# Altium project EIT_Teensybasedv1.PrjPcb (part 3 of 3)

## Sheet EIT_Teensy_Amplifiers.SchDoc: EIT Teensy Amplifiers
size A4; Author: Llewellyn Sims Johns
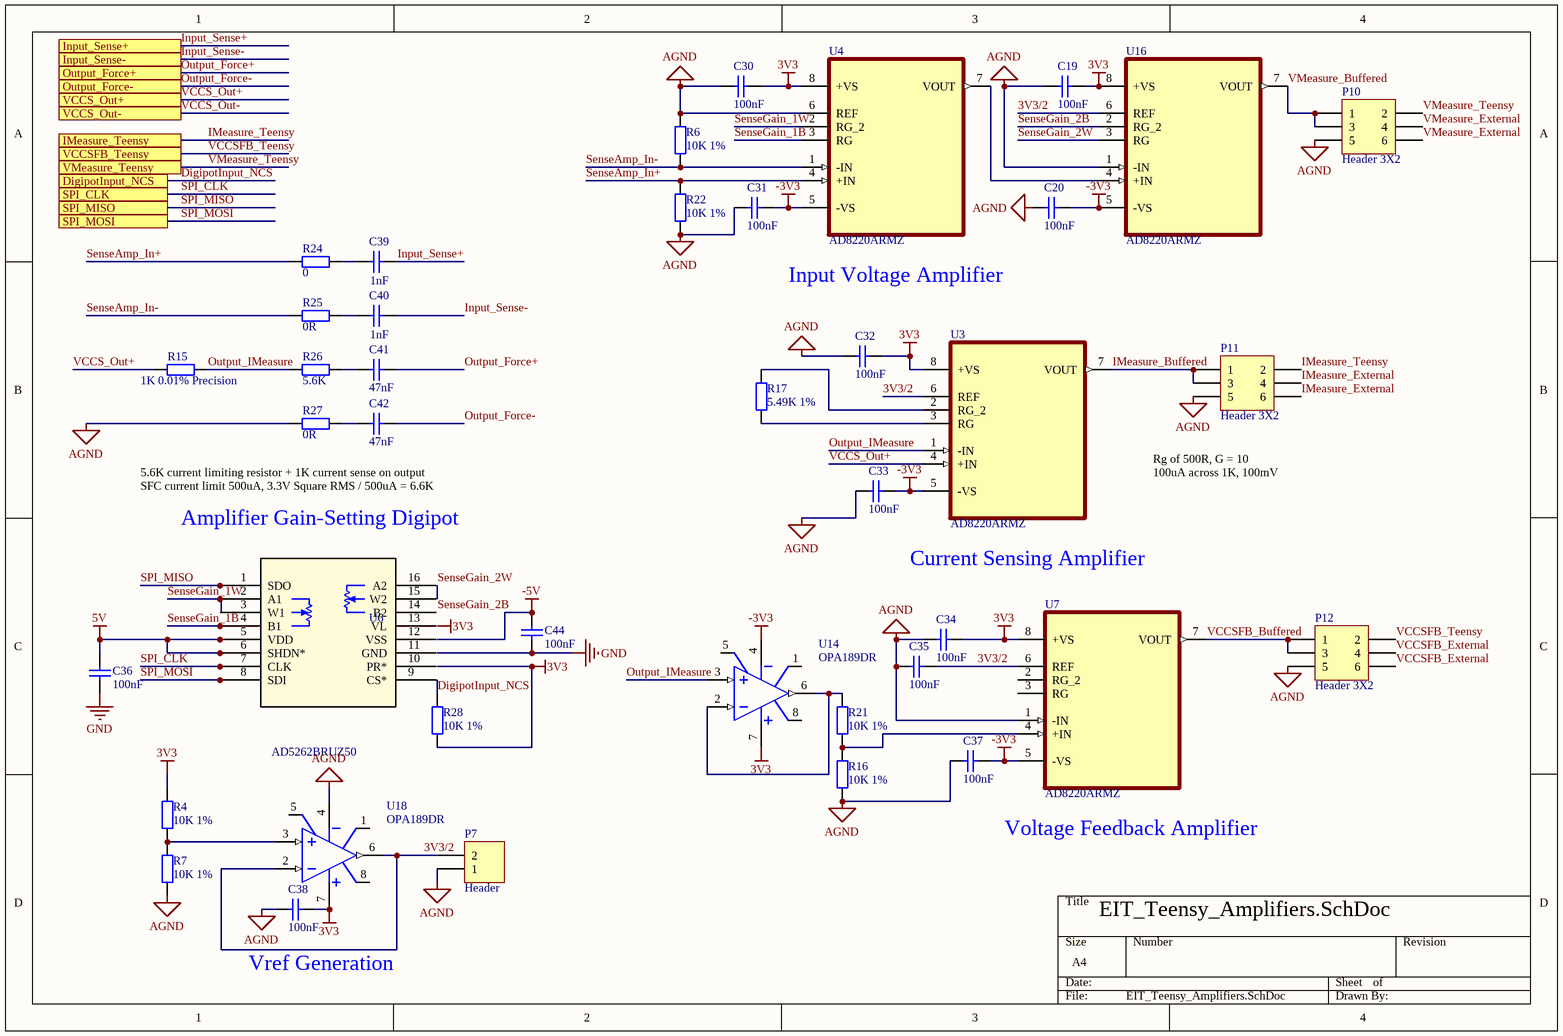
[diagram p7: EIT_Teensy_Amplifiers.SchDoc]

### Parts
C19  100nF  [0603 CAP]
C20  100nF  [0603 CAP]
C30  100nF  [0603 CAP]
C31  100nF  [0603 CAP]
C32  100nF  [0603 CAP]
C33  100nF  [0603 CAP]
C34  100nF  [0603 CAP]
C35  100nF  [0603 CAP]
C36  100nF  [0603 CAP]
C37  100nF  [0603 CAP]
C38  100nF  [0603 CAP]
C39  value 1nF  [RAD-0.3]  (hidden comment: Cap)
C40  value 1nF  [RAD-0.3]  (hidden comment: Cap)
C41  47nF  [0603 CAP]
C42  47nF  [0603 CAP]
C44  100nF  [0603 CAP]
P7  Header  [HEADER 2.54MM 2X1 MALE]
P10  Header 3X2  [HDR2X3 Male 2.54mm]
P11  Header 3X2  [HDR2X3 Male 2.54mm]
P12  Header 3X2  [HDR2X3 Male 2.54mm]
R4  10K 1%  [0603 RES]
R6  10K 1%  [0603 RES]
R7  10K 1%  [0603 RES]
R15  1K 0.01% Precision  [0603 RES]
R16  10K 1%  [0603 RES]
R17  5.49K 1%  [0603 RES]
R21  10K 1%  [0603 RES]
R22  10K 1%  [0603 RES]
R24  0  [0603 RES]
R25  0R  [0603 RES]
R26  5.6K  [0603 RES]
R27  0R  [0603 RES]
R28  10K 1%  [0603 RES]
U3  AD8220ARMZ  [SOP65P490X110-8N]
U4  AD8220ARMZ  [SOP65P490X110-8N]
U6  AD5262BRUZ50
U7  AD8220ARMZ  [SOP65P490X110-8N]
U14  OPA189DR  [8-SOIC]
U16  AD8220ARMZ  [SOP65P490X110-8N]
U18  OPA189DR  [8-SOIC]

### Ports
DigipotInput_NCS, IMeasure_Teensy, Input_Sense+, Input_Sense-, Output_Force+, Output_Force-, SPI_CLK, SPI_MISO, SPI_MOSI, VCCS_Out+, VCCS_Out-, VCCSFB_Teensy, VMeasure_Teensy

### Nets
3V3: C19.2 C30.2 C32.2 C34.2 C38.2 R4.2 R28.1 U3.8(+VS) U4.8(+VS) U7.8(+VS) U14.7(V+) U16.8(+VS) U18.7(V+)
5V: C36.2 U6.5(VDD) U6.6(SHDN*)
-3V3: C20.2 C31.2 C33.2 C37.2 U3.5(-VS) U4.5(-VS) U7.5(-VS) U14.4(V-) U16.5(-VS)
-5V: C44.2
AGND: C19.1 C20.1 C30.1 C31.1 C32.1 C33.1 C34.1 C35.1 C37.1 C38.1 P7.1 P10.5 P11.5 P12.5 R6.1 R7.1 R16.2 R22.2 R27.1 U4.6(REF) U7.1(-IN) U16.1(-IN) U18.4(V-)
GND: C36.1 C44.1
3V3/2: C35.2 P7.2 U3.6(REF) U7.6(REF) U16.6(REF) U18.2(IN-) U18.6(OUT)
DigipotInput_NCS: R28.2 ; port DigipotInput_NCS
IMeasure_Buffered: P11.1 P11.3 U3.7(VOUT)
IMeasure_External: P11.4 P11.6
IMeasure_Teensy: P11.2 ; port IMeasure_Teensy
Input_Sense+: C39.2 ; port Input_Sense+
Input_Sense-: C40.2 ; port Input_Sense-
Output_Force+: C41.2 ; port Output_Force+
Output_Force-: C42.2 ; port Output_Force-
Output_IMeasure: R15.2 R26.1 U3.1(-IN) U14.3(IN+)
SenseAmp_In+: R22.1 R24.1 U4.4(+IN)
SenseAmp_In-: R6.2 R25.1 U4.1(-IN)
SenseGain_1B: U4.3(RG) U6.4(B1)
SenseGain_1W: U4.2(RG_2) U6.2(A1)
SenseGain_2B: U16.2(RG_2)
SenseGain_2W: U16.3(RG)
SPI_CLK: U6.7(CLK) ; port SPI_CLK
SPI_MISO: U6.1(SDO) ; port SPI_MISO
SPI_MOSI: U6.8(SDI) ; port SPI_MOSI
VCCS_Out+: R15.1 U3.4(+IN) ; port VCCS_Out+
VCCSFB_Buffered: P12.1 P12.3 U7.7(VOUT)
VCCSFB_External: P12.4 P12.6
VCCSFB_Teensy: P12.2 ; port VCCSFB_Teensy
VMeasure_Buffered: P10.1 P10.3 U16.7(VOUT)
VMeasure_External: P10.4 P10.6
VMeasure_Teensy: P10.2 ; port VMeasure_Teensy
NetC39_1: C39.1 R24.2
NetC40_1: C40.1 R25.2
NetC41_1: C41.1 R26.2
NetC42_1: C42.1 R27.2
NetR4_1: R4.1 R7.2 U18.3(IN+)
NetR16_1: R16.1 R21.2 U7.4(+IN)
NetR17_1: R17.1 U3.2(RG_2)
NetR17_2: R17.2 U3.3(RG)
NetR21_1: R21.1 U14.2(IN-) U14.6(OUT)
NetU4_7: U4.7(VOUT) U16.4(+IN)

Not connected (* = marked no-connect by the designer): U6 3(W1) 9(CS*) 10(PR*) 11(GND) 12(VSS) 13(VL) 14(B2) 15(W2) 16(A2); U7 2(RG_2) 3(RG); U14 1(OS_NUL) 5(OS_NUL) 8(TAB); U18 1(OS_NUL) 5(OS_NUL) 8(TAB)

### Notes on the sheet
- Input Voltage Amplifier
- 5.6K current limiting resistor + 1K current sense on output
  SFC current limit 500uA, 3.3V Square RMS / 500uA = 6.6K
- Amplifier Gain-Setting Digipot
- Current Sensing Amplifier
- Rg of 500R, G = 10
  100uA across 1K, 100mV
- Voltage Feedback Amplifier
- (near C38) Vref Generation
- Labels drawn without touching a wire or pin: 3V3, SenseGain_2B

### Library data of the parts
C19 C20 C30-C38 C44 = Cap 0603 100nF 10% 50V: Multi Layer Ceramic Capacitor (MLCC) / Cap Ceramic 0.1uF 50V X7R 10% Pad SMD 0603 125¡ãC T/R; Manufacturer: Samsung; Manufacturer Part Number: CL10B104KB8NNNC; Supplier 1: Digi-Key; RoHS: Yes; Category: Ceramic Capacitors; Stock 1: 16768569; Pricing 1: 1=0.10000, 10=0.03000, 50=0.01620, 100=0.01330, 500=0.00950, 1000=0.00746 (USD); Mount: Surface Mount; Case/Package: 0603; Case Code (Metric): 1608; Case Code (Imperial): 0603; Material: Ceramic; Contact Plating: Tin; Min Operating Temperature: -55°C; Max Operating Temperature: 125°C; Tolerance: 10%; Package Quantity: 1; Packaging: Tape and Reel; Capacitance: 100nF; Dielectric: X7R; Series: CL; Voltage Rating: 50V; Voltage: 50V; Voltage Rating (DC): 50V; Construction: Flat; Length: 1.6mm; Width: 0.031inch; Height: 0.8mm; Depth: 0.8mm; Thickness: 0.035inch; Radiation Hardening: No; Lead Free: Lead Free; RoHS Compliant: Yes; ComponentLink1URL: https://datasheet.ciiva.com/25803/cl10b104kb8nnnc-25803393.pdf?src-supplier=Digi-Key; ComponentLink1Description: https://datasheet.ciiva.com/25803/cl10b104kb8nnnc-25803393.pdf?src-supplier=Digi-Key; ComponentLink2URL: https://datasheet.ciiva.com/26838/getdatasheetpartid-89097-26838411.pdf?src-supplier=Verical; ComponentLink2Description: https://datasheet.ciiva.com/26838/getdatasheetpartid-89097-26838411.pdf?src-supplier=Verical; ComponentLink3URL: https://datasheet.ciiva.com/29198/456651-da-01-en-vs-kondensator-0605-29198839.pdf?src-supplier=Conrad; ComponentLink3Description: https://datasheet.ciiva.com/29198/456651-da-01-en-vs-kondensator-0605-29198839.pdf?src-supplier=Conrad; Supplier Part Number 1: 1276-1000-1-ND
C39 C40 = Cap: Capacitor; Published: 8-Jun-2000; LatestRevisionDate: 17-Jul-2002; LatestRevisionNote: Re-released for DXP Platform.; PackageReference: RAD-0.3; Publisher: Altium Limited; PackageDescription: Radial Cap, Thru-Hole; 2 Leads; 0.3 in Pin Spacing
C41 C42 = Cap 0603 47nF 10% 50V: CAP CER 0.047UF 50V X7R 0603; Manufacturer: Samsung; Manufacturer Part Number: CL10B473KB8NNNC; Material: Ceramic; Tolerance: 10%; Dielectric: Y5V; Supplier 1: Digi-Key; RoHS: Yes; Category: Ceramic Capacitors; Stock 1: 641905; Pricing 1: 1=0.10000, 10=0.03200, 50=0.01740, 100=0.01420, 500=0.01012, 1000=0.00796 (USD); Mount: Surface Mount; Case/Package: 0603; Case Code (Metric): 1608; Case Code (Imperial): 0603; Contact Plating: Tin; Min Operating Temperature: -55°C; Max Operating Temperature: 125°C; Packaging: Tape and Reel; Package Quantity: 4000; Series: CL; Capacitance: 47nF; Voltage Rating: 50V; Voltage Rating (DC): 50V; Voltage: 50V; Construction: Flat; Length: 1.6mm; Width: 0.031inch; Height: 0.8mm; Thickness: 0.035inch; Depth: 0.8mm; Radiation Hardening: No; RoHS Compliant: Yes; Lead Free: Lead Free; ComponentLink1URL: https://datasheet.ciiva.com/25802/cl10b473kb8nnnc-25802915.pdf?src-supplier=Digi-Key; ComponentLink1Description: https://datasheet.ciiva.com/25802/cl10b473kb8nnnc-25802915.pdf?src-supplier=Digi-Key; ComponentLink2URL: https://datasheet.ciiva.com/15216/getdatasheetpartid-359560-15216232.pdf?src-supplier=Verical; ComponentLink2Description: https://datasheet.ciiva.com/15216/getdatasheetpartid-359560-15216232.pdf?src-supplier=Verical; ComponentLink3URL: https://datasheet.ciiva.com/29198/456947-da-01-en-vs-kondensator-0603-29198896.pdf?src-supplier=Conrad; ComponentLink3Description: https://datasheet.ciiva.com/29198/456947-da-01-en-vs-kondensator-0603-29198896.pdf?src-supplier=Conrad; ComponentLink4URL: https://datasheet.ciiva.com/26310/mlcc-catalogdownload2013-eng-26310327.pdf?src-supplier=Distrelec; ComponentLink4Description: https://datasheet.ciiva.com/26310/mlcc-catalogdownload2013-eng-26310327.pdf?src-supplier=Distrelec; ComponentLink5URL: https://datasheet.ciiva.com/20173/71-0317-20173339.pdf?src-supplier=Rapid+Electronics; ComponentLink5Description: https://datasheet.ciiva.com/20173/71-0317-20173339.pdf?src-supplier=Rapid+Electronics; Supplier Part Number 1: 1276-1063-1-ND
P7 = Header 2x1 2.54mm T/H Male: CONN HEADER VERT 2POS 2.54MM; Manufacturer: Sullins; Manufacturer Part Number: PRPC002SAAN-RC; Number of Positions: 2; Connector Type: Male Pin; Pitch: 0.1inch; Supplier 1: Digi-Key; RoHS: Yes; Category: Connectors; Stock 1: 34676; Pricing 1: 1=0.08000, 10=0.07300, 25=0.05400, 50=0.04640, 100=0.04490, 250=0.03872, 500=0.03716 (USD); Mount: Through Hole; Color: Black; Contact Plating: Gold; Package Quantity: 1; Number of Rows: 1; Termination: Solder; Packaging: Bulk; Contact Mating Length: 0.23inch; ComponentLink1URL: https://datasheet.ciiva.com/741/xrxczzzsxxn-rc-st-11635-b-741243.pdf?src-supplier=Digi-Key; ComponentLink1Description: https://datasheet.ciiva.com/741/xrxczzzsxxn-rc-st-11635-b-741243.pdf?src-supplier=Digi-Key; Supplier Part Number 1: S1011EC-02-ND
P10-P12 = Header 3X2 2.54mm Male: Header, 3-Pin, Dual row
R4 R6 R7 R16 R21 R22 R28 = Res 0603 10K 1%: Res General Purpose Thick Film 0603 10K Ohm 1% 1/10W ±100ppm/°C Molded SMD Paper T/R; Manufacturer: Yageo; Manufacturer Part Number: RC0603FR-0710KL; Voltage Rating: 75V; Resistance: 10kR; Power Rating: 100mW; Voltage Rating (DC): 50V; Supplier 1: Digi-Key; RoHS: Yes; Category: Chip SMD Resistors; Stock 1: 18430741; Pricing 1: 1=0.10000, 10=0.02400, 100=0.00970, 1000=0.00436, 2500=0.00378 (USD); Case/Package: 0603; Number of Pins: 2; Case Code (Imperial): 0603; Case Code (Metric): 1608; Size Code: 0603; Weight: 7.1E-05oz; Min Operating Temperature: -55°C; Max Operating Temperature: 155°C; Packaging: Tape and Reel; Tolerance: 1%; Termination: SMD/SMT; Resistor Type: Thick Film; Temperature Coefficient: 100ppm/°C; Features: Moisture Resistant; Series: RC; Max Power Dissipation: 100mW; Number of Terminations: 2; Resistance Tolerance: 1%; Construction: Rectangular; Length: 1.6mm; Width: 0.8mm; Height: 0.45mm; Depth: 0.8mm; Lead Pitch: 0.3mm; REACH SVHC: Unknown; Military Standard: Not; Lead Free: Lead Free; RoHS Compliant: Yes; ComponentLink1URL: https://datasheet.ciiva.com/15189/getdatasheetpartid-409289-15189591.pdf?src-supplier=Verical; ComponentLink1Description: https://datasheet.ciiva.com/15189/getdatasheetpartid-409289-15189591.pdf?src-supplier=Verical; ComponentLink2URL: https://datasheet.ciiva.com/7660/38590-7660789.pdf?src-supplier=Element14; ComponentLink2Description: https://datasheet.ciiva.com/7660/38590-7660789.pdf?src-supplier=Element14; ComponentLink3URL: https://datasheet.ciiva.com/7746/1738695-7746239.pdf?src-supplier=Element14; ComponentLink3Description: https://datasheet.ciiva.com/7746/1738695-7746239.pdf?src-supplier=Element14; ComponentLink4URL: https://datasheet.ciiva.com/7983/443971-7983596.pdf?src-supplier=Element14; ComponentLink4Description: https://datasheet.ciiva.com/7983/443971-7983596.pdf?src-supplier=Element14; ComponentLink5URL: https://datasheet.ciiva.com/22747/443971-22747519.pdf?src-supplier=Element14; ComponentLink5Description: https://datasheet.ciiva.com/22747/443971-22747519.pdf?src-supplier=Element14; ComponentLink6URL: https://datasheet.ciiva.com/46440/1868787-46440891.pdf?src-supplier=Element14; ComponentLink6Description: https://datasheet.ciiva.com/46440/1868787-46440891.pdf?src-supplier=Element14; Supplier Part Number 1: 311-10.0KHRCT-ND
R15 = Res 0603 1K 0.01%: RES 1K OHM 0.01% 1/10W 0603; Manufacturer: Stackpole Electronics; Manufacturer Part Number: RNCF0603TKY1K00; Resistance: 1kR; Max Power Dissipation: 100mW; Temperature Coefficient: 5ppm/°C; Supplier 1: Digi-Key; RoHS: Yes; Category: Chip SMD Resistors; Stock 1: 31380; Pricing 1: 1=1.86000, 10=1.65000, 100=1.26000 (USD); Mount: Surface Mount; Case/Package: 0603; Case Code (Metric): 1608; Case Code (Imperial): 0603; Min Operating Temperature: -55°C; Max Operating Temperature: 155°C; Tolerance: 0.01%; Packaging: Tape and Reel; Resistor Type: Thin Film; Number of Terminations: 2; Features: Moisture Resistant; Series: RNCF; Length: 0.063inch; Width: 0.031inch; Height: 0.022inch; Lead Free: Lead Free; RoHS Compliant: Yes; ComponentLink1URL: https://www.seielect.com/catalog/SEI-Packaging.pdf?src-supplier=Digi-Key; ComponentLink1Description: https://www.seielect.com/catalog/SEI-Packaging.pdf?src-supplier=Digi-Key; Supplier Part Number 1: RNCF0603TKY1K00CT-ND
R17 = Res 0603 5.49K 1%: Resistor;Resistance:5K49ohm;Resistance Tolerance:± 1%;Resistor Element Material:Thick Film;Resistor Case Style:0603; Manufacturer: Yageo; Manufacturer Part Number: RC0603FR-075K49L; Resistance: 5.49kR; Power Rating: 100mW; Temperature Coefficient: 100ppm/°C; Voltage Rating (DC): 50V; Supplier 1: Digi-Key; RoHS: Yes; Category: Chip SMD Resistors; Stock 1: 713644; Pricing 1: 1=0.10000, 10=0.02400, 100=0.00970, 1000=0.00436, 2500=0.00378 (USD); Case/Package: 0603; Case Code (Metric): 1608; Case Code (Imperial): 0603; Size Code: 0603; Min Operating Temperature: -55°C; Max Operating Temperature: 155°C; Tolerance: 1%; Packaging: Tape and Reel; Resistor Type: Thick Film; Number of Terminations: 2; Max Power Dissipation: 100mW; Features: Moisture Resistant; Series: RC; Construction: Rectangular; Package Quantity: 1; Length: 1.6mm; Width: 0.8mm; Height: 0.022inch; Depth: 0.8mm; Military Standard: Not; Lead Free: Lead Free; RoHS Compliant: Yes; ComponentLink1URL: https://datasheet.ciiva.com/2454/pyu-r-int-thick-7-2454378.pdf?src-supplier=Digi-Key; ComponentLink1Description: https://datasheet.ciiva.com/2454/pyu-r-int-thick-7-2454378.pdf?src-supplier=Digi-Key; ComponentLink2URL: https://datasheet.ciiva.com/2454/pyu-r-int-thick-7-2454379.pdf?src-supplier=Digi-Key; ComponentLink2Description: https://datasheet.ciiva.com/2454/pyu-r-int-thick-7-2454379.pdf?src-supplier=Digi-Key; ComponentLink3URL: https://datasheet.ciiva.com/2454/pyu-r-int-thick-7-2454380.pdf?src-supplier=Digi-Key; ComponentLink3Description: https://datasheet.ciiva.com/2454/pyu-r-int-thick-7-2454380.pdf?src-supplier=Digi-Key; ComponentLink4URL: https://datasheet.ciiva.com/12558/rc0603-272842-12558872.pdf?src-supplier=Mouser; ComponentLink4Description: https://datasheet.ciiva.com/12558/rc0603-272842-12558872.pdf?src-supplier=Mouser; Supplier Part Number 1: 311-5.49KHRCT-ND; Voltage Rating: 50V; Termination: SMD/SMT
R24 = Res 0603 4.7K 1%: RES SMD 4.7K OHM 1% 1/10W 0603; Manufacturer: Yageo; Manufacturer Part Number: RC0603FR-074K7L; Resistance: 4.7kR; Voltage Rating (DC): 50V; Temperature Coefficient: 100ppm/°C; Power Rating: 100mW; Supplier 1: Digi-Key; RoHS: Yes; Category: Chip SMD Resistors; Stock 1: 7608467; Pricing 1: 1=0.10000, 10=0.02400, 100=0.00970, 1000=0.00436, 2500=0.00378 (USD); Case/Package: 0603; Number of Pins: 2; Case Code (Imperial): 0603; Case Code (Metric): 1608; Size Code: 0603; Min Operating Temperature: -55°C; Max Operating Temperature: 155°C; Packaging: Tape and Reel; Tolerance: 1%; Resistor Type: Thick Film; Voltage Rating: 50V; Termination: SMD/SMT; Features: Moisture Resistant; Series: RC; Max Power Dissipation: 100mW; Number of Terminations: 2; Construction: Rectangular; Resistance Tolerance: 1%; Length: 1.6mm; Width: 0.8mm; Height: 0.45mm; Depth: 0.8mm; Lead Pitch: 0.3mm; REACH SVHC: No SVHC; Lead Free: Lead Free; Military Standard: Not; RoHS Compliant: Yes; ComponentLink1URL: https://datasheet.ciiva.com/15189/getdatasheetpartid-422754-15189760.pdf?src-supplier=Verical; ComponentLink1Description: https://datasheet.ciiva.com/15189/getdatasheetpartid-422754-15189760.pdf?src-supplier=Verical; ComponentLink2URL: https://datasheet.ciiva.com/22747/443971-22747528.pdf?src-supplier=Element14; ComponentLink2Description: https://datasheet.ciiva.com/22747/443971-22747528.pdf?src-supplier=Element14; ComponentLink3URL: https://datasheet.ciiva.com/7746/1868787-7746365.pdf?src-supplier=Element14; ComponentLink3Description: https://datasheet.ciiva.com/7746/1868787-7746365.pdf?src-supplier=Element14; ComponentLink4URL: https://datasheet.ciiva.com/7746/1738695-7746366.pdf?src-supplier=Element14; ComponentLink4Description: https://datasheet.ciiva.com/7746/1738695-7746366.pdf?src-supplier=Element14; ComponentLink5URL: https://datasheet.ciiva.com/46440/1868787-46440909.pdf?src-supplier=Element14; ComponentLink5Description: https://datasheet.ciiva.com/46440/1868787-46440909.pdf?src-supplier=Element14; ComponentLink6URL: https://datasheet.ciiva.com/7660/38590-7660794.pdf?src-supplier=Element14; ComponentLink6Description: https://datasheet.ciiva.com/7660/38590-7660794.pdf?src-supplier=Element14; Supplier Part Number 1: 311-4.70KHRCT-ND
R25-R27 = Res 0603 template: Resistor
U3 U4 U7 U16 = AD8220ARMZ: ANALOG DEVICES   AD8220BRMZ   Instrument Amplifier, 1, 125 V, 2 V/s, 800 kHz,  2.25V to  18V, MSOP; Number of Channels: 1; Common Mode Rejection Ratio: 100dB; Max Supply Voltage: 36V; Min Supply Voltage: 4.5V; -3db Bandwidth: 1.5MHz; Bandwidth: 800kHz; Slew Rate: 2V/µs; Input Bias Current: 10pA; Input Offset Voltage (Vos): 125uV; Operating Supply Current: 750uA; Output Current per Channel: 15mA; Voltage Gain: 60dB; Operating Supply Voltage: 28V; Dual Supply Voltage: 9V; Amplifier Type: INSTRUMENTATION AMPLIFIER; Supplier 1: Digi-Key; Manufacturer: Analog Devices; Manufacturer Part Number: AD8220BRMZ; RoHS: Yes; Category: Amplifiers - Op Amps, Buffer, Instrumentation; Stock 1: 568; Pricing 1: 1=10.39000, 10=9.38900, 25=8.95280, 100=7.77360, 250=7.42424, 500=6.76916, 1000=6.18000 (USD); Case/Package: MSOP; Number of Pins: 8; Min Operating Temperature: -40°C; Max Operating Temperature: 85°C; Min Dual Supply Voltage: 2.25V; Max Dual Supply Voltage: 18V; Package Quantity: 50; Packaging: Rail/Tube; Number of Circuits: 1; Number of Elements: 1; Series: -; Lead Free: Contains Lead; RoHS Compliant: Yes; ComponentLink1URL: https://datasheet.ciiva.com/15128/getdatasheetpartid-237631-15128545.pdf?src-supplier=Verical; ComponentLink1Description: https://datasheet.ciiva.com/15128/getdatasheetpartid-237631-15128545.pdf?src-supplier=Verical; ComponentLink2URL: https://datasheet.ciiva.com/26848/ad8220brmz-26848766.pdf?src-supplier=IIIC; ComponentLink2Description: https://datasheet.ciiva.com/26848/ad8220brmz-26848766.pdf?src-supplier=IIIC; Supplier Part Number 1: AD8220BRMZ-ND; Number of Amplifiers: 1; Length: 3mm; Width: 3mm; Height: 0.85mm; Radiation Hardening: No; REACH SVHC: No SVHC; ComponentLink3URL: https://datasheet.ciiva.com/1810/ad8220-1810510.pdf?src-supplier=Digi-Key; ComponentLink3Description: https://datasheet.ciiva.com/1810/ad8220-1810510.pdf?src-supplier=Digi-Key; ComponentLink4URL: https://datasheet.ciiva.com/2975/ad8220-2975654.pdf?src-supplier=Avnet; ComponentLink4Description: https://datasheet.ciiva.com/2975/ad8220-2975654.pdf?src-supplier=Avnet; ComponentLink5URL: https://datasheet.ciiva.com/1135/716986-1135108.pdf?src-supplier=Element14; ComponentLink5Description: https://datasheet.ciiva.com/1135/716986-1135108.pdf?src-supplier=Element14; ComponentLink6URL: https://datasheet.ciiva.com/17374/ad8220-17374085.pdf?src-supplier=Avnet+Europe; ComponentLink6Description: https://datasheet.ciiva.com/17374/ad8220-17374085.pdf?src-supplier=Avnet+Europe
U6 = AD5262BRUZ50: Digital Potentiometer, 2 Func, 50000ohm, 3-wire Serial Control Interface, 256 Positions, PDSO16; Manufacturer: Analog Devices; Number of Positions: 256; Package Body Material: Plastic; Bandwidth-Nom: 130Hz; Negative Supply Voltage-Nom: -5V; Channels: 2; Package Equivalence Code: TSSOP16,.25; Power Supplies: 5/15/+-5V; Resistance Law: Linear; Resistance Tolerance-Max: 30%; Resistor Terminal Voltage-Max: 5V; Temperature Coefficient-Nom: 35ppm/°C; Time @ Peak Reflow Temperature-Max (s): 30s; Total Resistance-Nom: 50kR; Qualification Status: Not Qualified; Manufacturer Part Number: AD5262BRUZ50; RoHS: Yes; Category: Digital Potentiometers; Case/Package: TSSOP; Min Operating Temperature: -40°C; Max Operating Temperature: 85°C; Length: 5mm; Width: 4.4mm; RoHS Compliant: Yes; ComponentLink1URL: https://datasheet.ciiva.com:443/pdfs/VipMasterIC/IC/ANDI/ANDIS19757/ANDIS19757-1.pdf?src-supplier=IHS+Markit; ComponentLink1Description: https://datasheet.ciiva.com:443/pdfs/VipMasterIC/IC/ANDI/ANDIS19757/ANDIS19757-1.pdf?src-supplier=IHS+Markit; ComponentLink2URL: https://datasheet.ciiva.com/3045/ad5260-5262-3045560.pdf?src-supplier=Avnet; ComponentLink2Description: https://datasheet.ciiva.com/3045/ad5260-5262-3045560.pdf?src-supplier=Avnet; ComponentLink3URL: https://datasheet.ciiva.com/1331/ad5260-5262-1331021.pdf?src-supplier=Digi-Key; ComponentLink3Description: https://datasheet.ciiva.com/1331/ad5260-5262-1331021.pdf?src-supplier=Digi-Key; Supplier: Digi-Key; Supplier Part Number: 505-AD5262BRUZ50-ND; Stock: 1452; Pricing: 1=6.18, 10=5.581, 25=5.3212, 100=4.6203, 250=4.41268, 500=4.02334, 1000=3.5042, 2500=3.37441 (USD); Pins: 16; Reach SVHC Compliant: Yes; Package Shape: Rectangular; Terminal Finish: Tin; JESD-609 Code: e3; Control Interface: 3-WIRE SERIAL; Converter Type: DIGITAL POTENTIOMETER; JESD-30 Code: R-PDSO-G16; Moisture Sensitivity Level: 1; Package Style: SMALL OUTLINE, THIN PROFILE, SHRINK PITCHMeter; Peak Reflow Temperature (Cel): 260°C; Resistor Terminal Voltage-Min: -5V; Nominal Supply Voltage: 5V; Surface Mount: Yes; Terminal Form: Gull Wing; Terminal Position: DUAL; Height - Seated (Max): 1.2mm; Terminal Pitch: 0.65mm; Temperature Grade: INDUSTRIAL; ComponentLink4URL: https://datasheet.ciiva.com/22652/686036-22652986.pdf?src-supplier=Element14; ComponentLink4Description: https://datasheet.ciiva.com/22652/686036-22652986.pdf?src-supplier=Element14
U14 U18 = OpAmp OPA189DR: 36V ZERO DRIFT OP-AMP; Manufacturer: Texas Instruments; Manufacturer Part Number: OPA189IDR; Number of Channels: 1; Slew Rate: 20V/µs; Gain Bandwidth Product: 14MHz; Input Bias Current: 70pA; Input Offset Voltage (Vos): 0.4uV; Operating Supply Current: 1.3mA; Supplier 1: Digi-Key; RoHS: Yes; Category: Amplifiers - Op Amps, Buffer, Instrumentation; Stock 1: 9768; Pricing 1: 1=2.85000, 10=2.56500, 25=2.41960, 100=2.06140, 250=1.93556, 500=1.69362, 1000=1.52471 (USD); Mount: Surface Mount; Case/Package: SOIC; Number of Pins: 8; Min Operating Temperature: -40°C; Max Operating Temperature: 125°C; Packaging: Tape and Reel; Number of Circuits: 1; RoHS Compliant: Yes; ComponentLink1URL: http://www.ti.com/lit/ds/symlink/opa189.pdf?src-supplier=Digi-Key; ComponentLink1Description: http://www.ti.com/lit/ds/symlink/opa189.pdf?src-supplier=Digi-Key; Supplier Part Number 1: 296-48941-1-ND

## Nets that join several sheets
3V3: EIT_Teensy_Teensy3.6 (D1.2 D2.2 D3.2 D4.4), EIT_Teensy_DDS (C15.2 R38.2), EIT_Teensy_Connections (P1.36), EIT_Teensy_Mux (14 pins), EIT_Teensy_PSU (C9.2 C13.2 U8.1), EIT_Teensy_VCCS (9 pins), EIT_Teensy_Amplifiers (13 pins)
5V: EIT_Teensy_Teensy3.6 (S2.2), EIT_Teensy_DDS (6 pins), EIT_Teensy_PSU (6 pins), EIT_Teensy_VCCS (C1.2 U15.5), EIT_Teensy_Amplifiers (C36.2 U6.5 U6.6)
-3V3: EIT_Teensy_Connections (P1.35), EIT_Teensy_Mux (U9.24 U10.24 U11.24 U12.24), EIT_Teensy_PSU (C21.2 C23.1 U8.7), EIT_Teensy_VCCS (6 pins), EIT_Teensy_Amplifiers (9 pins)
-5V: EIT_Teensy_PSU (5 pins), EIT_Teensy_VCCS (C43.2 U15.12), EIT_Teensy_Amplifiers (C44.2)
AGND: EIT_Teensy_Teensy3.6 (9 pins), EIT_Teensy_DDS (U17.9), EIT_Teensy_Connections (P1.34), EIT_Teensy_VCCS (14 pins), EIT_Teensy_Amplifiers (23 pins)
GND: EIT_Teensy_Teensy3.6 (8 pins), EIT_Teensy_DDS (5 pins), EIT_Teensy_Connections (P1.33), EIT_Teensy_Mux (U9.23 U10.23 U11.23 U12.23), EIT_Teensy_PSU (7 pins), EIT_Teensy_VCCS (C1.1 C43.1 U15.11), EIT_Teensy_Amplifiers (C36.1 C44.1)
DDS_NCS: EIT_Teensy_Teensy3.6 (P8.12 TEENSY1.10), EIT_Teensy_DDS (R38.1 U17.8)
DDS_OUT: EIT_Teensy_DDS (U17.10), EIT_Teensy_VCCS (P6.1)
DigipotInput_NCS: EIT_Teensy_Teensy3.6 (P9.6 TEENSY1.21), EIT_Teensy_Amplifiers (R28.2)
DigipotRShunt_NCS: EIT_Teensy_Teensy3.6 (P9.12 TEENSY1.15), EIT_Teensy_VCCS (R3.2 U15.9)
Electrode_1: EIT_Teensy_Connections (P1.1), EIT_Teensy_Mux (U9.12 U10.12 U11.12 U12.12)
Electrode_2: EIT_Teensy_Connections (P1.2), EIT_Teensy_Mux (U9.11 U10.11 U11.11 U12.11)
Electrode_3: EIT_Teensy_Connections (P1.3), EIT_Teensy_Mux (U9.10 U10.10 U11.10 U12.10)
Electrode_4: EIT_Teensy_Connections (P1.4), EIT_Teensy_Mux (U9.9 U10.9 U11.9 U12.9)
Electrode_5: EIT_Teensy_Connections (P1.5), EIT_Teensy_Mux (U9.8 U10.8 U11.8 U12.8)
Electrode_6: EIT_Teensy_Connections (P1.6), EIT_Teensy_Mux (U9.7 U10.7 U11.7 U12.7)
Electrode_7: EIT_Teensy_Connections (P1.7), EIT_Teensy_Mux (U9.6 U10.6 U11.6 U12.6)
Electrode_8: EIT_Teensy_Connections (P1.8), EIT_Teensy_Mux (U9.5 U10.5 U11.5 U12.5)
Electrode_9: EIT_Teensy_Connections (P1.9), EIT_Teensy_Mux (U9.4 U10.4 U11.4 U12.4)
Electrode_10: EIT_Teensy_Connections (P1.10), EIT_Teensy_Mux (U9.3 U10.3 U11.3 U12.3)
Electrode_11: EIT_Teensy_Connections (P1.11), EIT_Teensy_Mux (U9.2 U10.2 U11.2 U12.2)
Electrode_12: EIT_Teensy_Connections (P1.12), EIT_Teensy_Mux (U9.1 U10.1 U11.1 U12.1)
Electrode_13: EIT_Teensy_Connections (P1.13), EIT_Teensy_Mux (U9.48 U10.48 U11.48 U12.48)
Electrode_14: EIT_Teensy_Connections (P1.14), EIT_Teensy_Mux (U9.47 U10.47 U11.47 U12.47)
Electrode_15: EIT_Teensy_Connections (P1.15), EIT_Teensy_Mux (U9.46 U10.46 U11.46 U12.46)
Electrode_16: EIT_Teensy_Connections (P1.16), EIT_Teensy_Mux (U9.45 U10.45 U11.45 U12.45)
Electrode_17: EIT_Teensy_Connections (P1.17), EIT_Teensy_Mux (U9.25 U10.25 U11.25 U12.25)
Electrode_18: EIT_Teensy_Connections (P1.18), EIT_Teensy_Mux (U9.26 U10.26 U11.26 U12.26)
Electrode_19: EIT_Teensy_Connections (P1.19), EIT_Teensy_Mux (U9.27 U10.27 U11.27 U12.27)
Electrode_20: EIT_Teensy_Connections (P1.20), EIT_Teensy_Mux (U9.28 U10.28 U11.28 U12.28)
Electrode_21: EIT_Teensy_Connections (P1.21), EIT_Teensy_Mux (U9.29 U10.29 U11.29 U12.29)
Electrode_22: EIT_Teensy_Connections (P1.22), EIT_Teensy_Mux (U9.30 U10.30 U11.30 U12.30)
Electrode_23: EIT_Teensy_Connections (P1.23), EIT_Teensy_Mux (U9.31 U10.31 U11.31 U12.31)
Electrode_24: EIT_Teensy_Connections (P1.24), EIT_Teensy_Mux (U9.32 U10.32 U11.32 U12.32)
Electrode_25: EIT_Teensy_Connections (P1.25), EIT_Teensy_Mux (U9.33 U10.33 U11.33 U12.33)
Electrode_26: EIT_Teensy_Connections (P1.26), EIT_Teensy_Mux (U9.34 U10.34 U11.34 U12.34)
Electrode_27: EIT_Teensy_Connections (P1.27), EIT_Teensy_Mux (U9.35 U10.35 U11.35 U12.35)
Electrode_28: EIT_Teensy_Connections (P1.28), EIT_Teensy_Mux (U9.36 U10.36 U11.36 U12.36)
Electrode_29: EIT_Teensy_Connections (P1.29), EIT_Teensy_Mux (U9.37 U10.37 U11.37 U12.37)
Electrode_30: EIT_Teensy_Connections (P1.30), EIT_Teensy_Mux (U9.38 U10.38 U11.38 U12.38)
Electrode_31: EIT_Teensy_Connections (P1.31), EIT_Teensy_Mux (U9.39 U10.39 U11.39 U12.39)
Electrode_32: EIT_Teensy_Connections (P1.32), EIT_Teensy_Mux (U9.40 U10.40 U11.40 U12.40)
IMeasure_Teensy: EIT_Teensy_Teensy3.6 (R5.1), EIT_Teensy_Amplifiers (P11.2)
Input_Sense+: EIT_Teensy_Mux (U10.43), EIT_Teensy_Amplifiers (C39.2)
Input_Sense-: EIT_Teensy_Mux (U11.43), EIT_Teensy_Amplifiers (C40.2)
MuxEnable_In: EIT_Teensy_Teensy3.6 (P8.2 TEENSY1.0), EIT_Teensy_Mux (R2.1 U10.22 U11.22)
MuxEnable_Out: EIT_Teensy_Teensy3.6 (P9.24 TEENSY1.33), EIT_Teensy_Mux (R13.1 U9.22 U12.22)
MuxNCS_In+: EIT_Teensy_Teensy3.6 (P9.5 TEENSY1.22), EIT_Teensy_Mux (R34.1 U10.20 U10.21)
MuxNCS_In-: EIT_Teensy_Teensy3.6 (P9.7 TEENSY1.20), EIT_Teensy_Mux (R37.1 U11.20 U11.21)
MuxNCS_Out+: EIT_Teensy_Teensy3.6 (P8.9 TEENSY1.7), EIT_Teensy_Mux (R36.1 U12.20 U12.21)
MuxNCS_Out-: EIT_Teensy_Teensy3.6 (P8.10 TEENSY1.8), EIT_Teensy_Mux (R35.1 U9.20 U9.21)
MuxSelect_A0: EIT_Teensy_Teensy3.6 (P8.16 TEENSY1.24), EIT_Teensy_Mux (U9.15 U10.15 U11.15 U12.15)
MuxSelect_A1: EIT_Teensy_Teensy3.6 (P8.17 TEENSY1.25), EIT_Teensy_Mux (U9.16 U10.16 U11.16 U12.16)
MuxSelect_A2: EIT_Teensy_Teensy3.6 (P8.18 TEENSY1.26), EIT_Teensy_Mux (U9.17 U10.17 U11.17 U12.17)
MuxSelect_A3: EIT_Teensy_Teensy3.6 (P8.19 TEENSY1.27), EIT_Teensy_Mux (U9.18 U10.18 U11.18 U12.18)
MuxSelect_A4: EIT_Teensy_Teensy3.6 (P8.20 TEENSY1.28), EIT_Teensy_Mux (U9.19 U10.19 U11.19 U12.19)
Output_Force+: EIT_Teensy_Mux (U12.43), EIT_Teensy_Amplifiers (C41.2)
Output_Force-: EIT_Teensy_Mux (U9.43), EIT_Teensy_Amplifiers (C42.2)
SigGen_Teensy: EIT_Teensy_Teensy3.6 (P14.1 P14.3), EIT_Teensy_VCCS (P6.3)
SPI_CLK: EIT_Teensy_Teensy3.6 (P9.13 TEENSY1.14), EIT_Teensy_DDS (U17.7), EIT_Teensy_VCCS (U15.7), EIT_Teensy_Amplifiers (U6.7)
SPI_MISO: EIT_Teensy_Teensy3.6 (P8.14 TEENSY1.12), EIT_Teensy_VCCS (U15.1), EIT_Teensy_Amplifiers (U6.1)
SPI_MOSI: EIT_Teensy_Teensy3.6 (P8.13 TEENSY1.11), EIT_Teensy_DDS (U17.6), EIT_Teensy_VCCS (U15.8), EIT_Teensy_Amplifiers (U6.8)
VCCS_Out+: EIT_Teensy_VCCS (P3.2 R20.1 U2.3), EIT_Teensy_Amplifiers (R15.1 U3.4)
VCCSFB_Teensy: EIT_Teensy_Teensy3.6 (R8.1), EIT_Teensy_Amplifiers (P12.2)
VMeasure_Teensy: EIT_Teensy_Teensy3.6 (R14.1), EIT_Teensy_Amplifiers (P10.2)